# EAGLE design shrew-mini (EAGLE 7.6.0)
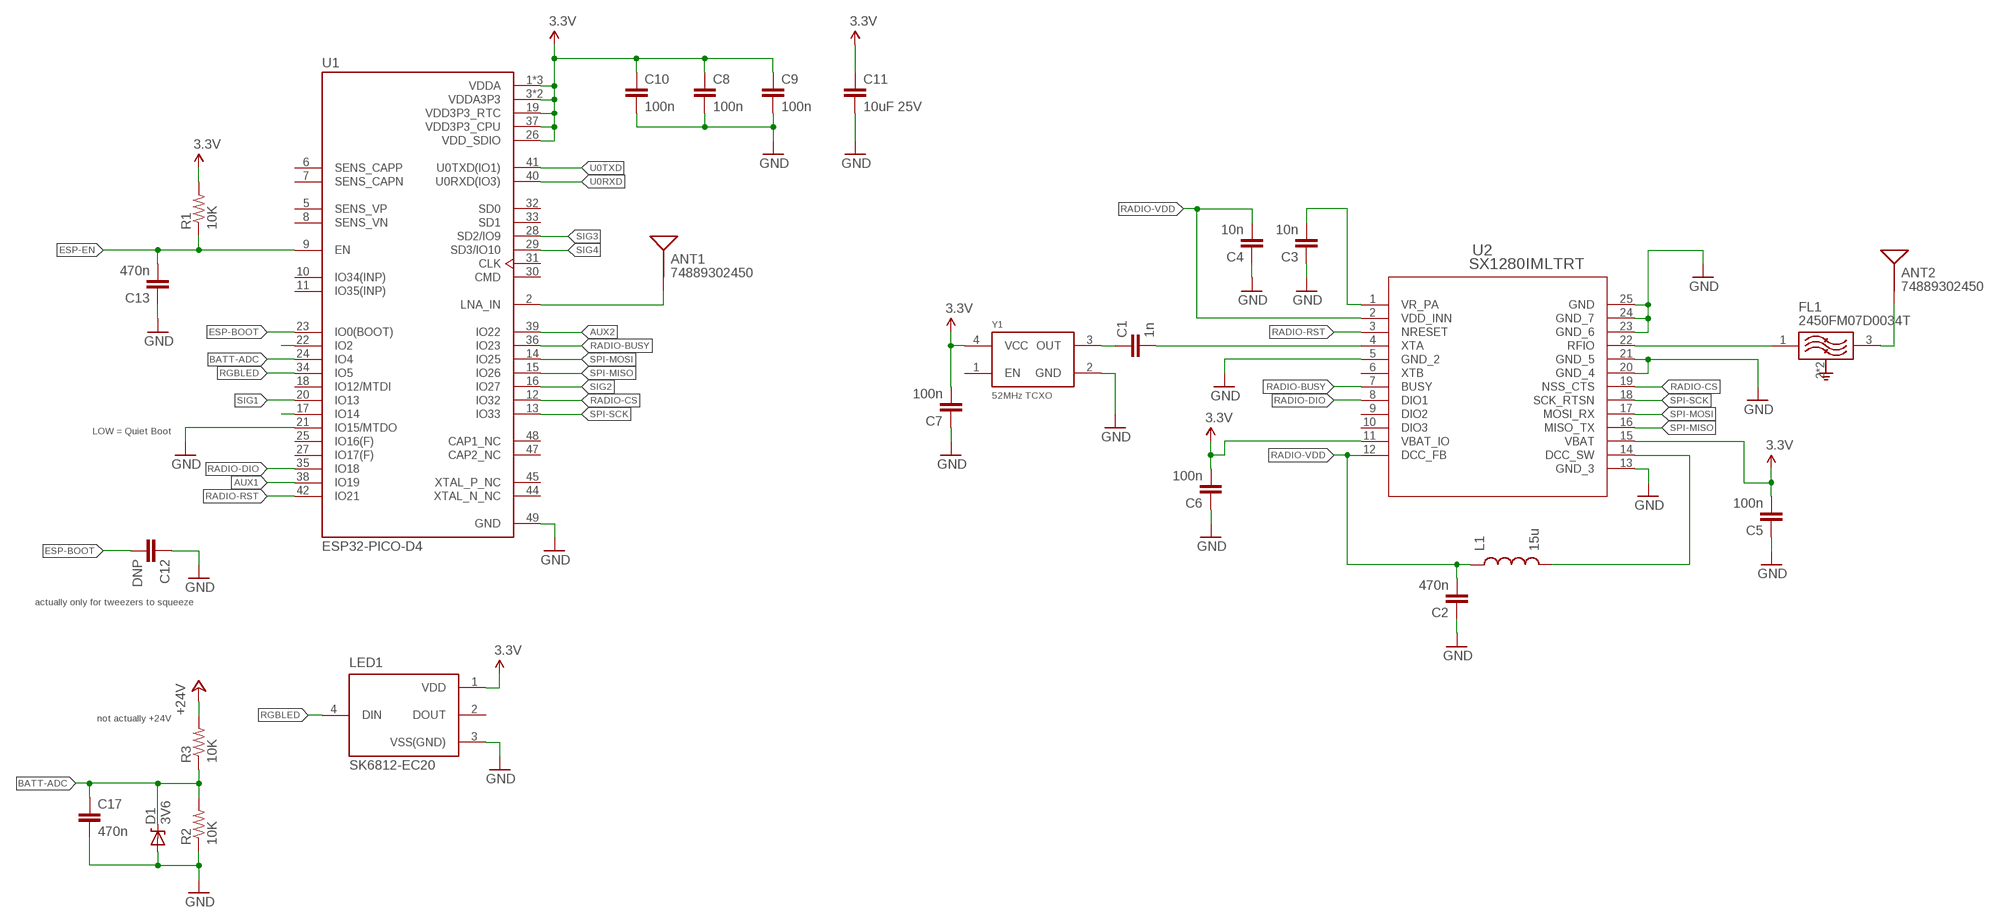
[diagram p0: schematic, sheet 1, part 1 of 2]
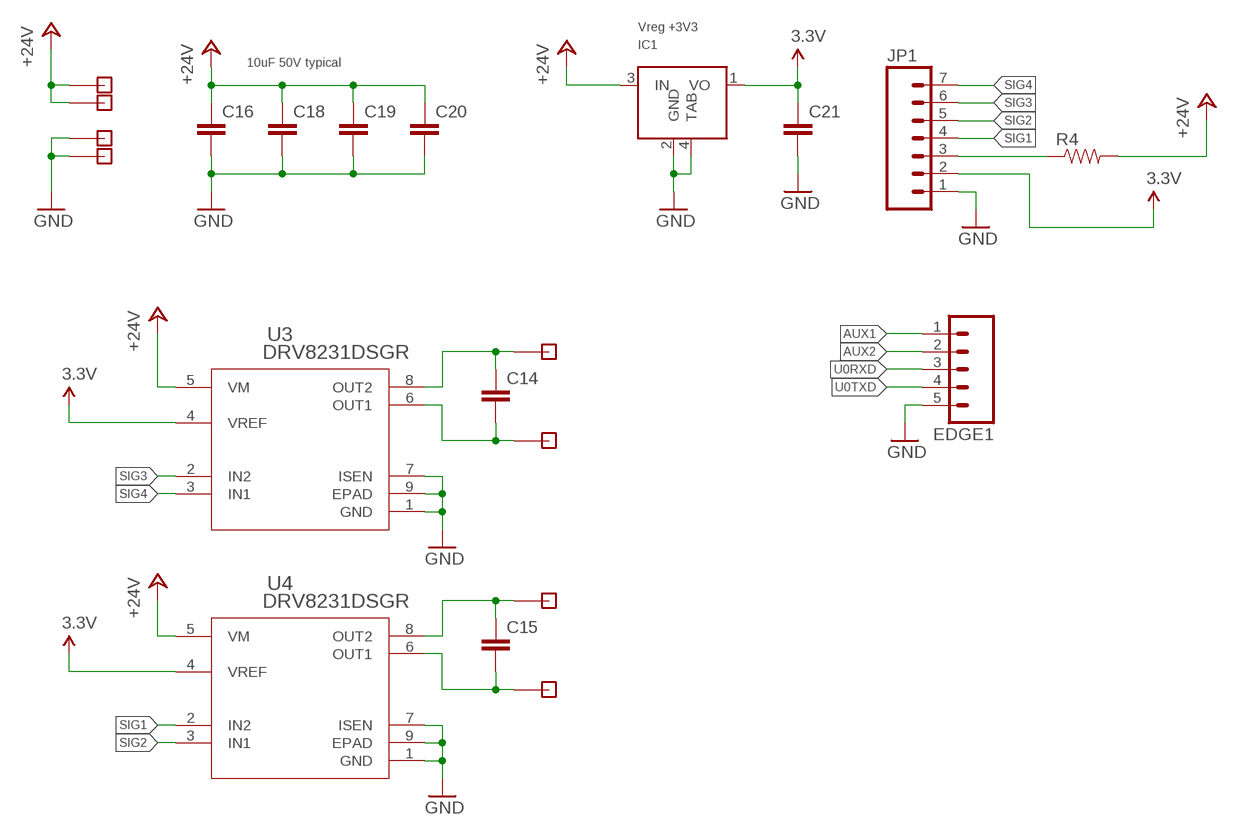
[diagram p1: schematic, sheet 1, part 2 of 2]

## Parts
ANT1  74889302450  ANTENNA2SMD  [ANTENNA-CHIP2]
ANT2  74889302450  ANTENNA2SMD  [ANTENNA-CHIP2]
C1  1n  CAP0402-REV  [0402-REV]
C2  470n  CAP0402-REV  [0402-REV]
C3  10n  CAP0402-REV  [0402-REV]
C4  10n  CAP0402-REV  [0402-REV]
C5  100n  CAP0402-REV  [0402-REV]
C6  100n  CAP0402-REV  [0402-REV]
C7  100n  CAP0402-REV  [0402-REV]
C8  100n  CAP0402-REV  [0402-REV]
C9  100n  CAP0402-REV  [0402-REV]
C10  100n  CAP0402-REV  [0402-REV]
C11  10uF 25V  CAP0805  [0805]
C12  DNP  CAP0402-CAP  [0402-CAP]
C13  470n  CAP0402-REV  [0402-REV]
C14  CAP0402-CAP  [0402-CAP]
C15  CAP0402-CAP  [0402-CAP]
C16  CAP0805  [0805]
C17  470n  CAP0402-REV  [0402-REV]
C18  CAP0805  [0805]
C19  CAP0805  [0805]
C20  CAP0805  [0805]
C21  CAP0805  [0805]
D1  3V6  DIODE-ZENER-BZT52  [SOD-323]
EDGE1  M05PTH  [1X05]
FL1  2450FM07D0034T  [FIL_2450FM07D0034T]
IC1  Vreg +3V3  V_REG_SOT89-SOT89  [SOT89]
JP1  M07-2MM-TH-TINY  [1X07-2MM-TH-TINY]
L1  15u  INDUCTOR0805  [0805]
LED1  SK6812-EC20  [SK6812-EC20]
R1  10K  RESISTOR0402-REV  [0402-REV]
R2  10K  RESISTOR0402-REV  [0402-REV]
R3  10K  RESISTOR0402-REV  [0402-REV]
R4  RESISTOR0402-RES  [0402-RES]
U1  ESP32-PICO-D4  [PQFN50P700X700X104-49N]
U2  SX1280IMLTRT  [QFN24_4X4_SEM]
U3  DRV8231DSGR  [WSON8_DRV8231_TEX]
U4  DRV8231DSGR  [WSON8_DRV8231_TEX]
X1  PIN-1X-BIG  [PAD-1X-BIG]
X2  PIN-1X-BIG  [PAD-1X-BIG]
X3  PIN-1X-BIG  [PAD-1X-BIG]
X4  PIN-1X-BIG  [PAD-1X-BIG]
X5  PIN-1X-MED  [PAD-1X-MED]
X6  PIN-1X-MED  [PAD-1X-MED]
X7  PIN-1X-MED  [PAD-1X-MED]
X8  PIN-1X-MED  [PAD-1X-MED]
Y1  52MHz TCXO  OSCILLATOR-TG2016SMN  [OSC_TG2016SMN_50.0000M-ECGNNMB]

## Nets
3.3V: C5.2 C6.2 C7.2 C8.1 C9.1 C10.1 C11.1 C21.1 IC1.1(VO) JP1.2 LED1.1(VDD) R1.2 U1.1(VDDA) U1.3(VDDA3P3) U1.4(VDDA3P3) U1.19(VDD3P3_RTC) U1.26(VDD_SDIO) U1.37(VDD3P3_CPU) U1.43(VDDA) U1.46(VDDA) U2.11(VBAT_IO) U2.15(VBAT) U3.4(VREF) U4.4(VREF) Y1.4(VCC)
+24V: C16.1 C18.1 C19.1 C20.1 IC1.3(IN) R4.2 U3.5(VM) U4.5(VM) X5.1 X7.1
AUX1: EDGE1.1 U1.38(IO19)
AUX2: EDGE1.2 U1.39(IO22)
BATT-ADC: C17.1 D1.1(C) R2.2 R3.1 U1.24(IO4)
ESP-BOOT: C12.2 U1.23(IO0(BOOT))
ESP-EN: C13.2 R1.1 U1.9(EN)
GND: C2.1 C3.1 C4.1 C5.1 C6.1 C7.1 C8.2 C9.2 C10.2 C11.2 C12.1 C13.1 C16.2 C17.2 C18.2 C19.2 C20.2 C21.2 D1.2(A) EDGE1.5 IC1.2(GND) IC1.4(TAB) JP1.1 LED1.3(VSS(GND)) R2.1 U1.21(IO15/MTDO) U1.49(GND) U2.5(GND_2) U2.13(GND_3) U2.20(GND_4) U2.21(GND_5) U2.23(GND_6) U2.24(GND_7) U2.25(GND) U3.1(GND) U3.7(ISEN) U3.9(EPAD) U4.1(GND) U4.7(ISEN) U4.9(EPAD) X6.1 X8.1 Y1.2(GND)
MOTOR1: C15.2 U4.6(OUT1) X3.1
MOTOR2: C15.1 U4.8(OUT2) X4.1
MOTOR3: C14.2 U3.6(OUT1) X1.1
MOTOR4: C14.1 U3.8(OUT2) X2.1
N$1: ANT1.FEED(SIGNAL) U1.2(LNA_IN)
N$2: C1.1 Y1.3(OUT)
N$3: C1.2 U2.4(XTA)
N$5: U1.17(IO14)
N$6: FL1.1(IN) U2.22(RFIO)
N$7: ANT2.FEED(SIGNAL) FL1.3(OUT)
N$8: U1.22(IO2)
N$9: L1.2 U2.14(DCC_SW)
N$11: C3.2 U2.1(VR_PA)
RADIO-BUSY: U1.36(IO23) U2.7(BUSY)
RADIO-CS: U1.12(IO32) U2.19(NSS_CTS)
RADIO-DIO: U1.35(IO18) U2.8(DIO1)
RADIO-RST: U1.42(IO21) U2.3(NRESET)
RADIO-VDD: C2.2 C4.2 L1.1 U2.2(VDD_INN) U2.12(DCC_FB)
RGBLED: LED1.4(DIN) U1.34(IO5)
SIG1: JP1.4 U1.20(IO13) U4.2(IN2)
SIG2: JP1.5 U1.16(IO27) U4.3(IN1)
SIG3: JP1.6 U1.28(SD2/IO9) U3.2(IN2)
SIG4: JP1.7 U1.29(SD3/IO10) U3.3(IN1)
SPI-MISO: U1.15(IO26) U2.16(MISO_TX)
SPI-MOSI: U1.14(IO25) U2.17(MOSI_RX)
SPI-SCK: U1.13(IO33) U2.18(SCK_RTSN)
U0RXD: EDGE1.3 U1.40(U0RXD(IO3))
U0TXD: EDGE1.4 U1.41(U0TXD(IO1))
V-ADC: JP1.3 R3.2 R4.1 ; supply symbol labelled +24V
Unconnected: LED1.2(DOUT) U1.5(SENS_VP) U1.6(SENS_CAPP) U1.7(SENS_CAPN) U1.8(SENS_VN) U1.10(IO34(INP)) U1.11(IO35(INP)) U1.18(IO12/MTDI) U1.25(IO16(F)) U1.27(IO17(F)) U1.30(CMD) U1.31(CLK) U1.32(SD0) U1.33(SD1) U1.44(XTAL_N_NC) U1.45(XTAL_P_NC) U1.47(CAP2_NC) U1.48(CAP1_NC) U2.6(XTB) U2.9(DIO2) U2.10(DIO3) Y1.1(EN)

## Notes on the sheet
- 10uF 50V typical
- LOW = Quiet Boot
- actually only for tweezers to squeeze
- not actually +24V

## Power pins joined to a net without a drawn wire
GND: FL1.2(GND) FL1.4(GND)

## Library data of the parts
ANT1 ANT2 = shrew-common:ANTENNA2: Antenna Single endded antenna. Common with smaller chip antennas. CHIP4 package is the GPS Chip Antenna SKU: GPS-08418. CHIP5 package is 2.4GHz chip antenna SKU: WRL-00144.
C1-C21 = shrew-common:CAP: Capacitor Standard 0603 ceramic capacitor, and 0.1" leaded capacitor.
D1 = shrew-common:DIODE-ZENER: Zener Diode Production Part - 8199 3.4V Zener Voltage
EDGE1 = shrew-common:M05: Header 5 Standard 5-pin 0.1" header. Use with straight break away headers (SKU : PRT-00116), right angle break away headers (PRT-00553), swiss pins (PRT-00743), machine pins (PRT-00117), and female headers (PRT-00115). Molex polarized connector foot print use with SKU : PRT-08230 with associated crimp pins and housings.
FL1 = shrew-core:2450FM07D0034T: 2.4GHz ~ 2.5GHz Frequency RF Filter (Radio Frequency) 100MHz Bandwidth 0.75dB 0402 (1005 Metric), 4 PC Pad Check availability <https://pricing.snapeda.com/parts/2450FM07D0034T/Johanson%20Technology%20Inc./view-part?ref=eda>; AVAILABILITY: In Stock; CHECK_PRICES: https://www.snapeda.com/parts/2450FM07D0034T/Johanson+Technology+Inc./view-part/?ref=eda; DESCRIPTION: 2.4GHz ~ 2.5GHz Frequency - RF Filter (Radio Frequency) 100MHz Bandwidth 0.75dB 0402 (1005 Metric), 4 PC Pad; MF: Johanson Technology Inc.; MP: 2450FM07D0034T; PACKAGE: 0402 Johanson Technology Inc.; PRICE: None; SNAPEDA_LINK: https://www.snapeda.com/parts/2450FM07D0034T/Johanson+Technology+Inc./view-part/?ref=snap
IC1 = shrew-common:V_REG_SOT89
JP1 = shrew-common:M07: Header 7 Standard 7-pin 0.1" header. Use with straight break away headers (SKU : PRT-00116), right angle break away headers (PRT-00553), swiss pins (PRT-00743), machine pins (PRT-00117), and female headers (PRT-00115). NOTES ON THE VARIANTS LOCK and LOCK_LONGPADS... This footprint was designed to help hold the alignment of a through-hole component (i.e. 7-pin header) while soldering it into place. You may notice that each hole has been shifted either up or down by 0.005 of an inch from it's more standard position (which is usually a perfectly straight line). This slight alteration caused the pins (the squares in the middle) to touch the edges of the holes. Because they are alternating, it causes a "brace" to hold the header in place. 0.005 has proven to be the perfect amount of "off-center" position when using our standard breakaway headers. Although looks a little odd when you look at the bare footprint, once you have a header in there, the alteration is very hard to notice. Also, if you push a header all the way into place, it is covered up entirely on the bottom side. This idea of altering the position of holes to aid alignment will be further integrated into the Sparkfun Library for other footprints. It can help hold any component with 3 or more connection pins.
L1 = shrew-common:INDUCTOR: Inductors Basic Inductor/Choke - 0603 and 1206. Footprints are not proven and vary greatly between part numbers.
LED1 = shrew-core:SK6812: SMD 5050 Full color RGB LED data transmission frequency up to 800Kbps, with 30 fps refresh rate, 5.00x5.00 mm Check availability <https://pricing.snapeda.com/parts/SK6812/Shenzhen%20LED%20Color%20Optoelectronic%20Inc./view-part?ref=eda>
R1-R4 = shrew-common:RESISTOR: Resistor Basic schematic elements and footprints for 0603, 1206, and PTH resistors.
U1 = shrew-core:ESP32-PICO-D4: Bluetooth, WiFi 802.11b/g/n, Bluetooth v4.2 +EDR, Class 1, 2 and 3 Transceiver Module 2.4GHz ~ 2.5GHz Surface Mount Check availability <https://pricing.snapeda.com/parts/ESP32-PICO-D4/Espressif%20Systems/view-part?ref=eda>; AVAILABILITY: In Stock; CHECK_PRICES: https://www.snapeda.com/parts/ESP32-PICO-D4/Espressif+Systems/view-part/?ref=eda; DESCRIPTION: Bluetooth, WiFi 802.11b/g/n, Bluetooth v4.2 +EDR, Class 1, 2 and 3 Transceiver Module 2.4GHz ~ 2.5GHz - Surface Mount; MF: Espressif Systems; MP: ESP32-PICO-D4; PACKAGE: SMD-48 Espressif Systems; PRICE: None; SNAPEDA_LINK: https://www.snapeda.com/parts/ESP32-PICO-D4/Espressif+Systems/view-part/?ref=snap
U2 = shrew-core:SX1280IMLTRT; COPYRIGHT: Copyright (C) 2024 Ultra Librarian. All rights reserved.; MANUFACTURER_PART_NUMBER: SX1280IMLTRT; MFR_NAME: Semtech
U3 U4 = shrew-core:DRV8231DSGR; COPYRIGHT: Copyright (C) 2024 Ultra Librarian. All rights reserved.; MANUFACTURER_PART_NUMBER: DRV8231DSGR; MFR_NAME: Texas Instruments
X1-X8 = shrew-core:PIN-1X
Y1 = shrew-common:OSCILLATOR

## Board
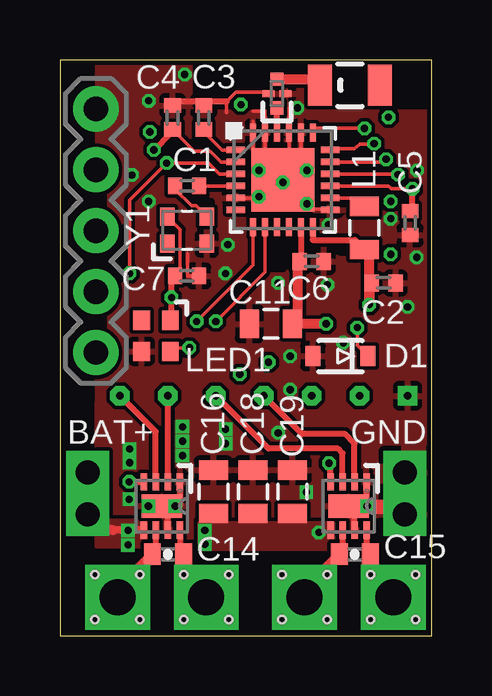
[diagram p2: board, top side]
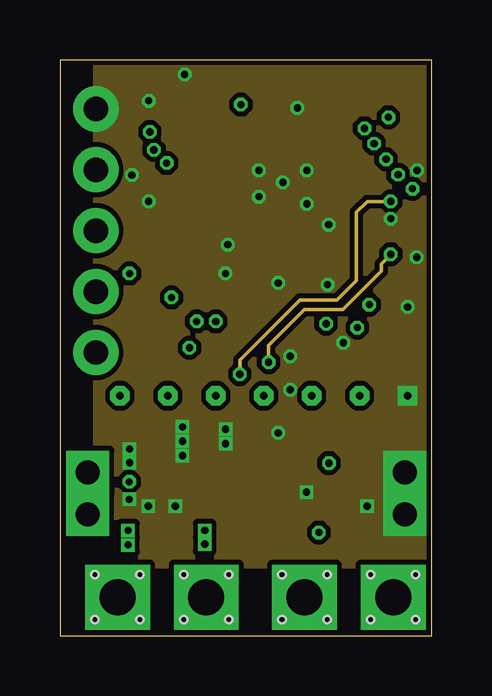
[diagram p3: board, inner layer Route2]
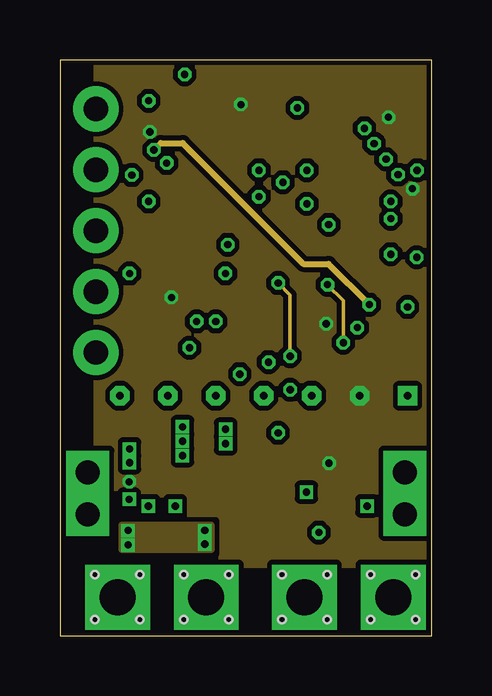
[diagram p4: board, inner layer Route15]
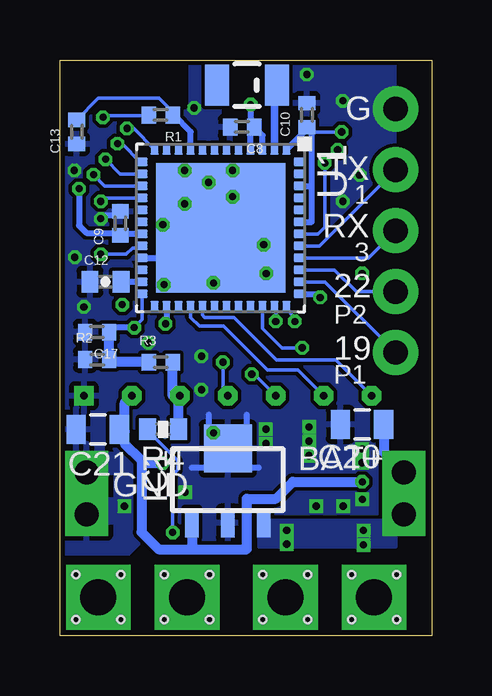
[diagram p5: board, bottom side, seen from below]

Size 15.5 x 24 mm. Coordinates in mm from the lower left corner, seen from the top.
Outline: 15.5,9 15.5,24 0,24 0,0 15.5,0 15.5,11
Copper layers (1+2*15+16): Top 0.035mm / dielectric 0.2mm / Route2 0.0175mm / dielectric 1.065mm / Route15 0.0175mm / dielectric 0.2mm / Bottom 0.035mm
Design rules "jlcpcb-4layers": minimum track width 3.5mil, minimum drill 0.2mm, track to track 5mil, track to pad 5mil, pad to pad 5mil, via to via 5mil, smd to smd 5mil, copper to edge 0.2mm, drill to drill 6mil, minimum pad ring 10mil, minimum via ring 0.13mm, stop-mask expansion 0.05mm, vias tented up to drill 16mil, thermal gap 8mil
tRestrict: area 11.1,22.1 to 12.9,23.8; area 5.7,22.1 to 8.6,24; area 12.9,22.1 to 15.3,23.8; 11 lines
bRestrict: area 10.3,22.1 to 13.9,23.8; 5 lines
vRestrict: area 10.3,22.1 to 13.9,23.8; area 5.7,22.4 to 9.5,24; area 13.9,22.1 to 15.3,23.8; 1 lines

### Footprints (pad centres in the part's own frame; a part is rotated, then mirrored left to right if it is on the bottom)
ANTENNA-CHIP2 = smd 1.7 x 1: ? 0,-1.25; FEED 0,1.25
0402-REV = smd 0.6 x 0.7: 1 -0.5,0; 2 0.5,0
0805 = smd 0.8 x 1.2: 1 -0.9,0; 2 0.9,0
0402-CAP = smd 0.7 x 0.9: 1 -0.65,0; 2 0.65,0
SOD-323 = smd 0.63 x 0.83: 1 -1.15,0; 2 1.15,0
1X05 = drill 1.016 pad 1.88: 1 0,0; 2 2.54,0; 3 5.08,0; 4 7.62,0; 5 10.16,0
FIL_2450FM07D0034T = smd 0.55 x 0.55: 1 -0.6,0; 3 0.6,0 | smd 0.3 x 0.5: 2 0,-0.35; 4 0,0.35
SOT89 = smd 0.58 x 1.2: 1 -1.5,-1.8; 2 0,-1.8; 3 1.5,-1.8 | smd 2 x 2: 4 0,1.3
1X07-2MM-TH-TINY = drill 0.3 square: 1 6,0 | drill 0.3 octagon: 2 4,0; 3 2,0; 4 0,0; 5 -2,0; 6 -4,0; 7 -6,0
SK6812-EC20 = smd 0.8 x 0.7: 1 0.65,-0.6; 2 0.65,0.6; 3 -0.65,0.6; 4 -0.65,-0.6
0402-RES = smd 0.7 x 0.9: 1 -0.65,0; 2 0.65,0
PQFN50P700X700X104-49N = smd 0.45 x 0.35: 1 -3.265,2.75; 2 -3.265,2.25; 3 -3.265,1.75; 4 -3.265,1.25; 5 -3.265,0.75; 6 -3.265,0.25; 7 -3.265,-0.25; 8 -3.265,-0.75; 9 -3.265,-1.25; 10 -3.265,-1.75; 11 -3.265,-2.25; 12 -3.265,-2.75; 25 3.265,-2.75; 26 3.265,-2.25; 27 3.265,-1.75; 28 3.265,-1.25; 29 3.265,-0.75; 30 3.265,-0.25; 31 3.265,0.25; 32 3.265,0.75; 33 3.265,1.25; 34 3.265,1.75; 35 3.265,2.25; 36 3.265,2.75 | smd 0.35 x 0.45: 13 -2.75,-3.265; 14 -2.25,-3.265; 15 -1.75,-3.265; 16 -1.25,-3.265; 17 -0.75,-3.265; 18 -0.25,-3.265; 19 0.25,-3.265; 20 0.75,-3.265; 21 1.25,-3.265; 22 1.75,-3.265; 23 2.25,-3.265; 24 2.75,-3.265; 37 2.75,3.265; 38 2.25,3.265; 39 1.75,3.265; 40 1.25,3.265; 41 0.75,3.265; 42 0.25,3.265; 43 -0.25,3.265; 44 -0.75,3.265; 45 -1.25,3.265; 46 -1.75,3.265; 47 -2.25,3.265; 48 -2.75,3.265 | smd 5.4 x 5.4: 49 0,0
QFN24_4X4_SEM = smd 0.762 x 0.254: 1 -1.968,1.25; 2 -1.968,0.75; 3 -1.968,0.25; 4 -1.968,-0.25; 5 -1.968,-0.75; 6 -1.968,-1.25; 13 1.968,-1.25; 14 1.968,-0.75; 15 1.968,-0.25; 16 1.968,0.25; 17 1.968,0.75; 18 1.968,1.25 | smd 0.254 x 0.762: 7 -1.25,-1.968; 8 -0.75,-1.968; 9 -0.25,-1.968; 10 0.25,-1.968; 11 0.75,-1.968; 12 1.25,-1.968; 19 1.25,1.968; 20 0.75,1.968; 21 0.25,1.968; 22 -0.25,1.968; 23 -0.75,1.968; 24 -1.25,1.968 | smd 2.642 x 2.642: 25 0,0
WSON8_DRV8231_TEX = smd 0.711 x 0.279: 1 -1.003,0.75; 2 -1.003,0.25; 3 -1.003,-0.25; 4 -1.003,-0.75; 5 1.003,-0.75; 6 1.003,-0.25; 7 1.003,0.25; 8 1.003,0.75 | smd 0.991 x 1.702: 9 0,0
PAD-1X-BIG = drill 1.5 pad 2.5 square: 1 0,0 | hole 0.3: -0.94,0.94; 0.94,0.94; -0.94,-0.94; 0.94,-0.94
PAD-1X-MED = drill 1 pad 1.8 square: 1 0,0
OSC_TG2016SMN_50.0000M-ECGNNMB = smd 0.75 x 0.6: 1 -0.565,0.825; 2 -0.565,-0.825; 3 0.565,-0.825; 4 0.565,0.825

### Placement (x,y rotation side)
ANT1  7.7,22.95 270 bottom
ANT2  12.1,22.95 90 top
C1  5.3,18.75 0 top
C2  13.5,14.7 180 top
C3  6,21.6 270 top
C4  4.7,21.6 270 top
C5  14.6,17.2 90 top
C6  10.5,15.6 180 top
C7  5.3,15 180 top
C8  7.9,21.2 180 bottom
C9  12.98,17.18 90 bottom
C10  5.2,21.7 90 bottom
C11  8.8,13 180 top
C12  13.6,14.75 0 bottom
C13  14.8,21 90 bottom
C14  4.5,3.39 180 top
C15  12.3,3.39 180 top
C16  6.4,6 90 top
C17  13.95,12.65 180 bottom
C18  8.05,6 90 top
C19  9.7,6 90 top
C20  2.9,8.8 180 bottom
C21  13.92,8.6 180 bottom
D1  11.7,11.65 180 top
EDGE1  1.5,11.8 90 top
FL1  9.05,22.6 90 top
IC1  8.5,6.5 0 bottom
JP1  8.5,10 0 top
L1  12.7,17 90 top
LED1  4,12.5 90 top
R1  11.3,21.7 180 bottom
R2  13.95,11.51 0 bottom
R3  11.3,11.4 0 bottom
R4  11.2,8.6 180 bottom
U1  8.8,17 270 bottom
U2  9.3,19 0 top
U3  4.25,5.4 270 top
U4  12.04,5.4 270 top
X1  2.4,1.6 0 top
X2  6.1,1.6 0 top
X3  10.2,1.6 0 top
X4  13.9,1.6 0 top
X5  1.16,5.06 0 top
X6  14.39,5.06 0 top
X7  1.16,6.8 0 top
X8  14.39,6.8 0 top
Y1  5.3,16.9 90 top

### Tracks (layer width: path | path; a pad name or v marks a point on that pad's centre or on a via)
3.3V  (via drill 0.3)
  Top 0.152: Y1.4 5.02,16.92 5.02,15 C7.2 | U2.15 13.7,18.75 13.82,18.63 v14.7,18.63
  Top 0.254: U2.11 10.05,15.9 C6.2 | 4.47,17.5 Y1.4 | LED1.1 4.65,13.2 v4.65,14.1 4.65,15 C7.2 | C5.2 14.7,17.7 v14.7,18.63 | U4.4 11.29,7.19 v11.22,7.19 | v2.89,6.41 U3.4
  Top 0.406: v11.1,13 9.85,13 9.85,13.15 C11.1 9.91,13 9.91,15.51 C6.2
  Bottom 0.152: v3.75,21 5,21 5.06,21 | v13.7,21.61 13.64,21.67 11.8,21.67 R1.2
  Bottom 0.254: U1.3 7.05,20.85 C8.1 | U1.4 7.55,20.9 C8.1 | v7.55,22.14 7.55,21.6 C8.1 | U1.1 5.26,21.05 C10.1 5,21.05 5,21 5,18.75 | U1.46 5,18.75 | U1.43 5,17.25 5,18.75 | U1.37 4.65,14.25 v4.65,14.1 | v14.7,18.63 14.7,17.1 14.39,16.79 12.98,16.79 C9.1 12.98,16.75 U1.19 | U1.26 11.05,13.05 v11.1,13
  Bottom 0.406: IC1.1 10,3.6 | 10,3.6 7.7,3.6 7.7,5.7 6.5,5.7 5.79,6.41 v2.89,6.41 | 12.1,7.3 12.1,4.31 11.39,3.6 10,3.6 | 12.1,7.3 12.8,8 12.8,8.5 | 12.1,7.3 11.99,7.19 v11.22,7.19 | C21.1 13.02,8.5 12.8,8.5 | 12.8,8.5 12.8,9.7 JP1.2
  pour Route15 (isolate 0.203, rank 5, no thermals): 1.5,2.9 1.5,24 15.5,24 15.5,2.9
+24V  (via drill 0.3)
  Top 0.305: 2.2,4.4 U3.5
  Top 0.406: X5.1 1.9,4.46 2.2,4.4
  Bottom 0.152: v10.8,4.3 10.8,6.7 10.6,6.9 10.6,7.3 11.85,8.55 R4.2
  Bottom 0.406: C20.1 2,7.64 X7.1 X5.1
  other vias: 6.04,4.38 6.04,3.81 2.84,4.38 2.84,3.78
  pour Top (isolate 0.152, no thermals): 1.5,4.8 3.6,4.8 3.6,3.7 1.5,3.7
  pour Bottom (isolate 0.152, no thermals): 1.5,4.8 7.2,4.8 7.2,3.7 1.5,3.7
  pour Top (isolate 0.152, no thermals): 5.8,3.6 11.4,3.6 11.4,4.7 5.8,4.7
  pour Route15 (isolate 0.305, no thermals): 2.6,4.6 6.3,4.6 6.3,3.6 2.6,3.6
AUX1
  Bottom 0.152: U1.38 4.45,14.75 EDGE1.1
AUX2
  Bottom 0.152: U1.39 4.05,15.25 3.14,14.34 EDGE1.2
BATT-ADC  (via drill 0.3)
  Top 0.152: D1.1 12.4,12.1 v12.4,12.84
  Bottom 0.152: v12.4,12.84 12.06,13.18 U1.24
  Bottom 0.254: v12.4,12.84 13.45,12.84 C17.1
  Bottom 0.406: C17.1 R2.2 13.2,11.4 R3.1
ESP-BOOT
  Bottom 0.152: C12.2 12.9,14.75
  Bottom 0.254: U1.23 12.9,14.75
ESP-EN
  Bottom 0.152: C13.2 13.9,22.4 11.36,22.4 10.8,21.84 R1.1
  Bottom 0.254: U1.9 10.05,21 10.75,21.7 R1.1
GND  (via drill 0.3)
  Top 0.152: v9.9,22 9.55,22 U2.21 | 5.33,15.93 5.33,15 5.69,15 | U2.5 9.3,18.25 U2.25 | 11.14,17.78 9.3,17.78 U2.25 | 10.05,20.79 10.05,19 U2.25 | U2.21 9.55,19 U2.25 | U2.25 8.55,19 U2.23 8.55,21.87 8.05,21.87 | 8.05,21.45 8.05,19 U2.25 | 8.74,22.66 7.34,22.66 6.95,22.27 6.95,21.8 | U2.21 9.55,19.4 v10.3,19.4 | 4.48,5.2 U3.9
  Top 0.254: 6.95,22.27 6,22.27 | 6,22.27 4.77,22.27 | C3.1 6,22.27 | U3.7 4.5,5.4 v4.81,5.4 5,5.4 U3.1 | U4.7 12.29,5.4 U4.9 12.79,5.4 U4.1
  Top 0.6: 14.4,5.36 12.7,5.36
  Route15 0.152: v11.16,14.62 11.82,13.96 v11.82,12.21 | v9.6,11.65 9.6,14.2 v9.11,14.69
  Bottom 0.152: U1.49 9.3,17.5 v9.3,18.9 | 13.8,7.3 13.8,6.8 X8.1
  Bottom 0.254: U1.21 11.16,15.75 v11.16,14.63 | C9.2 13.15,17.51 13.8,17.51 v13.8,17.38 | 7.2,7 10,7 | 7.7,8.6 7.7,9.2 | 9.3,9.2 9.3,7.8 IC1.4
  other vias: 11.21,17.13 14.88,15.77 8.3,19.4 8.3,18.3 10.3,18 7,16.3 6.9,15.1 3.7,18.1 3.7,22.3 5.2,23.4 14.9,19.4 14.5,13.7 3,19.2 2.89,5.68 3.69,5.4 5.11,7.5 5.11,8.1 5.11,8.7 2.9,7.21 2.9,7.78 6.91,8.6 6.91,8 10.28,5.98 9.6,10.25 9.1,8.45 12.81,5.4
  pour Top (isolate 0.152, rank 5): 1.5,2.3 1.5,24 15.5,24 15.5,2.3
  pour Bottom (isolate 0.152, rank 5): 1.5,3.4 1.5,24 15.5,24 15.5,3.4
  pour Route2 (isolate 0.203, no thermals): 1.5,2.9 1.5,24 15.5,24 15.5,2.9
  pour Top (isolate 0.152, no thermals): 1.5,24 1.5,19.5 2.8,19.5 2.8,24
  pour Bottom (isolate 0.152, no thermals): 1.5,24 2.8,24 2.8,19.5 1.5,19.5
  pour Bottom (isolate 0.152, no thermals): 13.2,6.9 14,6.9 14,8.1 13.7,8.1 13.7,7.6 13.2,7.6
  pour Top (isolate 0.152, no thermals): 13.2,7.1 13.2,6.4 15.2,6.4 15.2,8.3 14.3,8.3 14.3,7.1
  pour Bottom (isolate 0.152, no thermals): 13.2,5.7 13.2,4.7 15.1,4.7 15.1,5.7
MOTOR1
  Top 0.254: U4.6 11.79,3.39 C15.2
  Top 0.406: C15.2 10.2,1.94 X3.1
MOTOR2
  Top 0.254: U4.8 12.79,3.39 C15.1 12.95,1.6 X4.1
MOTOR3
  Top 0.254: U3.6 4,3.39 C14.2
  Top 0.406: C14.2 2.4,1.94 X1.1
MOTOR4
  Top 0.254: U3.8 5,3.39 C14.1 5.15,1.6 X2.1
N$1
  Bottom 0.305: U1.2 6.55,22.95 ANT1.FEED
N$2
  Top 0.152: Y1.3 5.67,17.92 5.48,17.92 4.8,18.6 C1.1
N$3
  Top 0.152: C1.2 U2.4
N$6
  Top 0.25: U2.22 FL1.1
N$7
  Top 0.406: FL1.3 10.85,23.2 ANT2.FEED
N$9
  Top 0.152: U2.14 12.3,18.25 L1.2
N$11
  Top 0.152: U2.1 6.75,20.25 6.05,20.95 C3.2
RADIO-BUSY  (via drill 0.3)
  Top 0.152: U2.7 8.05,15.45 v5.7,13.1
  Bottom 0.152: v5.7,13.1 5.82,13.22 5.73,13.29 6.05,13.61 U1.36
RADIO-CS  (via drill 0.3)
  Top 0.152: v12.7,21.15 10.55,21.15 U2.19
  Bottom 0.152: U1.12 12.44,21.15 v12.7,21.15
RADIO-DIO  (via drill 0.3)
  Top 0.152: U2.8 8.55,15.15 v6.5,13.1
  Bottom 0.152: U1.35 6.5,13.73 v6.5,13.1
RADIO-RST  (via drill 0.3)
  Top 0.152: U2.3 6.65,19.25 6.2,19.7 v4.45,19.7 2.9,18.15 v2.9,15.1
  Bottom 0.152: U1.42 4.74,16.75 4.45,17.04 v4.45,19.7
RADIO-VDD  (via drill 0.3)
  Top 0.152: U2.2 6.71,19.75 6.26,20.2 5.6,20.2 C4.2 4.7,20.97 4.64,20.97
  Top 0.254: 12.5,16.1 L1.1 12.3,16.5 10.55,16.5 U2.12 | v3.92,20.25 4.64,20.97
  Top 0.406: L1.1 12.9,16.1 v12.9,13.8 12.9,14.7 C2.2
  Route15 0.254: v3.92,20.25 4.2,20.53 5.12,20.53 10.15,15.5 11.2,15.5 v12.9,13.8
RGBLED  (via drill 0.3)
  Top 0.152: LED1.4 4.75,12 v5.4,12
  Bottom 0.152: v5.4,12 6.25,12 7.05,12.8 U1.34
SIG1  (via drill 0.3)
  Top 0.254: U4.2 12.29,8 11.89,8.4 10.1,8.4 JP1.4
  Route2 0.152: v8.7,11.4 8.7,12.1 10.2,13.6 11.8,13.6 13.4,15.2 13.4,15.5 v13.8,15.9
  Bottom 0.152: v13.8,15.9 12.73,15.9 12.46,16.16 12.06,16.16 U1.20 | v8.7,11.4 8.7,10.2 JP1.4
SIG2  (via drill 0.3)
  Top 0.254: U4.3 11.79,7.6 11.59,7.8 8.7,7.8 JP1.5
  Route2 0.152: v7.5,10.9 7.5,11.5 10,14 11.56,14 12.36,14.8 12.36,17.65 12.81,18.1 v13.8,18.1
  Bottom 0.152: U1.16 13.65,18.25 v13.8,18.1 | v7.5,10.9 7.4,10.9 JP1.5
SIG3
  Top 0.254: U3.2 JP1.6 | JP1.6
  Bottom 0.152: JP1.6 5.57,11.07 6.85,11.07 8.68,12.9 9.68,12.9 10.05,13.27 U1.28
SIG4
  Top 0.254: U3.3 4,8.5 3.9,8.6 JP1.7
  Bottom 0.152: JP1.7 3.98,11.48 6.46,11.48 8.25,13.27 9.46,13.27 9.55,13.36 U1.29
SPI-MISO  (via drill 0.3)
  Top 0.152: U2.16 14.07,19.25 v14.1,19.22
  Bottom 0.152: U1.15 13.63,18.75 v14.1,19.22
SPI-MOSI  (via drill 0.3)
  Top 0.152: U2.17 13.49,19.75 v13.6,19.86
  Bottom 0.152: U1.14 12.99,19.25 v13.6,19.86
SPI-SCK  (via drill 0.3)
  Top 0.152: U2.18 11.55,20.25 11.6,20.3 12.29,20.3 12.5,20.5 v13.09,20.5 arc90 v13.1,20.51
  Bottom 0.152: U1.13 12.15,19.75 12.91,20.51 v13.1,20.51
U0RXD
  Bottom 0.152: U1.40 2.63,15.75 EDGE1.3
U0TXD
  Bottom 0.152: U1.41 4.67,16.25 EDGE1.4
V-ADC
  Bottom 0.406: R3.2 10.8,10 10.55,10 | R4.1 10.55,10 | 10.55,10 JP1.3

### Text on the board
tPlace: BAT+ | GND
bPlace: G | TX | 1 | RX | 3 | 22 | P2 | 19 | P1 | BAT+ | GND